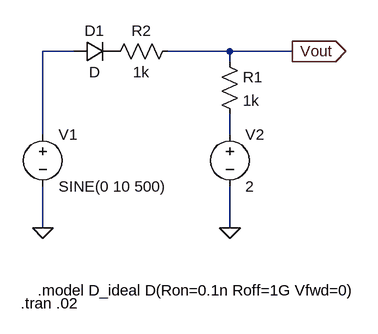
[diagram p0: schematic Draft3.asc]
Draft3.asc, the LTspice schematic file:
Version 4
SHEET 1 1408 680
WIRE 96 80 48 80
WIRE 336 80 240 80
WIRE 432 80 336 80
WIRE 336 96 336 80
WIRE 48 208 48 80
WIRE 336 208 336 176
WIRE 48 352 48 288
WIRE 336 352 336 288
FLAG 48 352 0
FLAG 336 352 0
FLAG 432 80 Vout
IOPIN 432 80 Out
SYMBOL voltage 48 192 R0
WINDOW 123 0 0 Left 0
WINDOW 39 0 0 Left 0
SYMATTR InstName V1
SYMATTR Value SINE(0 10 500)
SYMBOL voltage 336 192 R0
WINDOW 123 0 0 Left 0
WINDOW 39 0 0 Left 0
SYMATTR InstName V2
SYMATTR Value 2
SYMBOL res 320 80 R0
SYMATTR InstName R1
SYMATTR Value 1k
SYMBOL res 256 64 R90
WINDOW 0 0 56 VBottom 2
WINDOW 3 32 56 VTop 2
SYMATTR InstName R2
SYMATTR Value 1k
SYMBOL diode 96 96 R270
WINDOW 0 32 32 VTop 2
WINDOW 3 0 32 VBottom 2
SYMATTR InstName D1
TEXT 40 448 Left 2 !.model D_ideal D(Ron=0.1n Roff=1G Vfwd=0)
TEXT 14 468 Left 2 !.tran .02

The netlist it stands for:
* Draft3.asc
V1 N001 0 SINE(0 10 500)
V2 N002 0 2
R1 Vout N002 1k
R2 Vout P001 1k
D1 N001 P001 D
.model D D
.lib standard.dio
.model D_ideal D(Ron=0.1n Roff=1G Vfwd=0)
.tran .02
.backanno
.end